# Altium schematic sheet Radio.SchDoc
size A; SheetNumber: 5; SheetTotal: 5; SPICEModelCacheYGONGDQV: <root> / <DocumentId>YGONGDQV</DocumentId> / <CacheFrame Number="0"> / <Model Name="pmos" Kind="MDL"> / <Text>*Default P-Channel MOSFET / *Pinout: D,G,S / .MODEL PMOS PMOS()</Text> / </Model> / <Model Name="cap" Kind="MDL"> / <Text>*Default semiconductor capacitor / .MODEL CAP C()</Text> / </Model> / </CacheFrame> / </root>
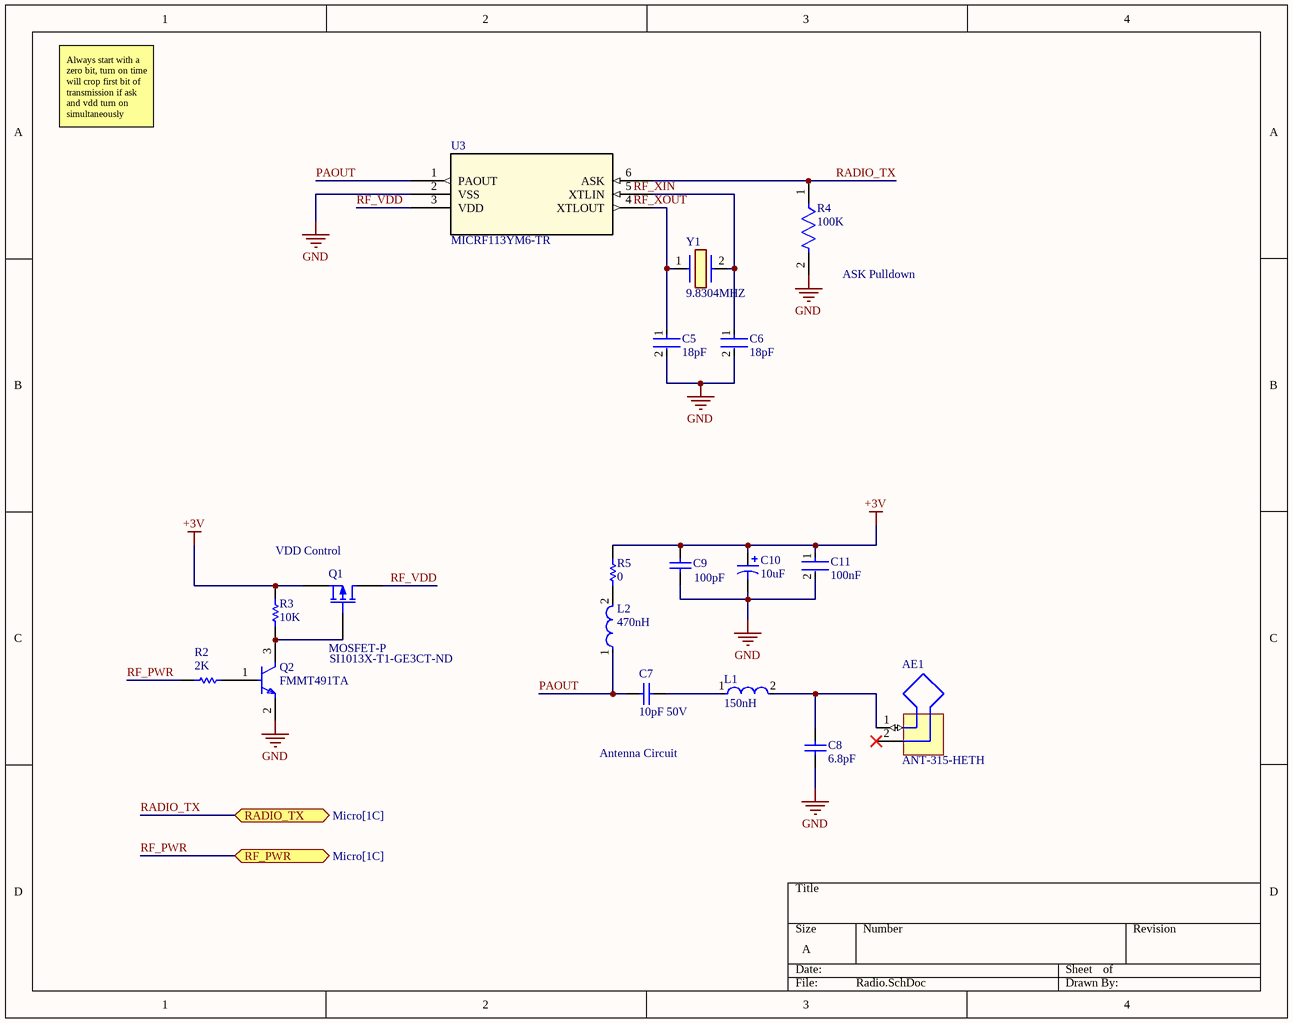
[diagram p0: Radio.SchDoc]

## Parts
AE1  ANT-315-HETH  [ANT-xxx-HETH]
C5  18pF  [FP-0402-L_1_0_1-W_0_5_0_1-MFG]
C6  18pF  [FP-0402-L_1_0_1-W_0_5_0_1-MFG]
C7  10pF 50V  [CAPC1608X90X35LL10T15]
C8  6.8pF  [CAPC1005X55X25NL05T10]
C9  100pF  [CAPC1608X90X35NL10T15]
C10  10uF  [C0805]
C11  100nF  [FP-C0402-BB-MFG]
L1  150nH  [FP-LQM18NN_00-IPC_B]
L2  470nH  [FP-LQW2UAS_00-MFG]
Q1  MOSFET-P  Supplier Part Number 1: SI1013X-T1-GE3CT-ND  [SC89-3_0P95X1P7_ONS]
Q2  FMMT491TA  [FP-SOT23-MFG]
R2  2K  [RESC1005X40X25LL05T05]
R3  10K  [RESC1005X40X25LL05T05]
R4  100K  [FP-ERJ2RK-IPC_C]
R5  0  [RESC1005X40X25LL05T05]
U3  MICRF113YM6-TR  [SOT23-6_N]
Y1  9.8304MHZ  [HC/49US-(AT49)_1]

## Ports
RADIO_TX (bidir, see Micro[1C]), RF_PWR (bidir, see Micro[1C])

## Nets
+3V: C9.2 C10.1 C11.1 Q1.3(S) R3.2 R5.2
GND: C5.2 C6.2 C8.1 C9.1 C10.2 C11.2 Q2.2(E) R4.2 U3.2(VSS)
PAOUT: C7.1 L2.1 U3.1(PAOUT)
RADIO_TX: R4.1 U3.6(ASK) ; port RADIO_TX
RF_PWR: R2.1 ; port RF_PWR
RF_VDD: Q1.1(D) U3.3(VDD)
NetAE1_1: AE1.1(High_Band_Feed) C8.2 L1.2
NetC5_1: C5.1 U3.4(XTLOUT) Y1.1
NetC6_1: C6.1 U3.5(XTLIN) Y1.2
NetC7_2: C7.2 L1.1
NetL2_2: L2.2 R5.1
NetQ1_2: Q1.2(G) Q2.3(C) R3.1
NetQ2_1: Q2.1(B) R2.2

Not connected (* = marked no-connect by the designer): AE1 2(Low_Band_Feed)*

## Notes on the sheet
- Always start with a zero bit, turn on time will crop first bit of transmission if ask and vdd turn on simultaneously
- (near R4) ASK Pulldown
- VDD Control
- Antenna Circuit
- Labels drawn without touching a wire or pin: RF_XIN, RF_XOUT

## Library data of the parts
AE1 = CMP-0172-00019-1: Embeddable 1/4-wave Monopole Antenna, HE Series, 315MHz, Thru-Hole; PackageReference: ANT-xxx-HETH; PackageDescription: Helical Antenna, HE Series, Thru-Hole, 2-Lead, 1.5" x 0.35" Body; DatasheetVersion: Feb-2002; PackageVersion: Feb-2002
C5 C6 = CMP-1034-00865-3: General Purpose Ceramic Capacitor, 0402, 18pF, 5%, C0G, 30ppm/°C, 50V; Insulation Resistance: 100GR; Length: 1mm; Voltage Rating (DC): 50V; Dielectric: C0G; Dielectric Material: Ceramic; Thickness: 0.022inch; Max Operating Temperature: 125°C; Min Operating Temperature: -55°C; RoHS Compliant: Yes; Package Quantity: 1; Mount: Surface Mount; Case Code (Imperial): 0402; REACH SVHC: No SVHC; Termination: SMD/SMT; Voltage: 50V; Number of Pins: 2; Contact Plating: Tin; Radiation Hardening: No; Voltage Rating: 50V; Capacitance: 18pF; Case Code (Metric): 1005; Case/Package: 0402; Tolerance: 5%; Packaging: Tape and Reel; Temperature Coefficient: 0ppm/°C; Depth: 0.5mm; Width: 0.02inch; Lead Free: Lead Free; Height: 0.5mm
C7 = CMP-2006-02592-1: Part Number: GRM1885C1H100JA01D; Manufacturer: Murata; Supplier 1: Digi-Key; Supplier Part Number 1: 490-1403-1-ND
C8 = CMP-2008-04424-1: Manufacturer: Murata; Part Number: GRM1555C1H6R8DA01D
C9 = CMP-2006-02595-1: Part Number: GRM1885C1H101JA01D; Manufacturer: Murata; Supplier 1: Digi-Key; Supplier Part Number 1: 490-1427-6-ND
C10 = Cap Pol3: Alum. Electrolytic Cap 10µF 50V; 5mm Surface Mount; Lifetime 2000h; +105°C; Manufacturer: Wurth Electronics; Manufacturer Part Number: 865080642006; Polarity: Polar; Ripple Current: 95mA; Impedance: 2.8R; Life (Hours): 2000Hour; Tolerance: 20%; Published: 8-Jun-2000; LatestRevisionDate: 29-May-2009; LatestRevisionNote: IPC-7351 Footprint Added.; PackageReference: C0805; Publisher: Altium Limited; PackageDescription: Chip Capacitor; RoHS: Yes; Category: Aluminum Electrolytic Capacitors; Stock 1: 1; Pricing 1: 25=0.20400 (USD); Mount: Surface Mount; Case/Package: Radial; Min Operating Temperature: -55°C; Max Operating Temperature: 105°C; Package Quantity: 1; Packaging: Cut Tape; Voltage Rating: 50V; Ripple Current (AC): 95mA; Voltage Rating (DC): 50V; Capacitance: 10uF; Diameter: 5mm; Height: 5.5mm; Height - Seated (Max): 0.217inch; REACH SVHC: Unknown; RoHS Compliant: Yes; ComponentLink1URL: http://www.farnell.com/datasheets/1880176.pdf?src-supplier=Farnell; ComponentLink1Description: http://www.farnell.com/datasheets/1880176.pdf?src-supplier=Farnell; ComponentLink2URL: http://www.farnell.com/datasheets/1880176.pdf?src-supplier=Element14; ComponentLink2Description: http://www.farnell.com/datasheets/1880176.pdf?src-supplier=Element14; ComponentLink3URL: http://www.farnell.com/datasheets/1880176.pdf?src-supplier=Newark; ComponentLink3Description: http://www.farnell.com/datasheets/1880176.pdf?src-supplier=Newark; ComponentLink4URL: http://katalog.we-online.de/pbs/datasheet/865080642006.pdf?src-supplier=Digi-Key; ComponentLink4Description: http://katalog.we-online.de/pbs/datasheet/865080642006.pdf?src-supplier=Digi-Key; ComponentLink5URL: https://katalog.we-online.de/pbs/datasheet/865080642006.pdf?src-supplier=Digi-Key; ComponentLink5Description: https://katalog.we-online.de/pbs/datasheet/865080642006.pdf?src-supplier=Digi-Key; Supplier 1: RSComponents; Supplier Part Number 1: 8391862P
C11 = CMP-2008-02046-2: CAP CER 0.1UF 10V X5R 0402; Manufacturer: Kemet; Manufacturer Part Number: C0402C104K8PACTU; Material: Ceramic; Capacitance: 0.10 μF; Temperature Coefficient: 15%; Tolerance: 0.1; Value: 0.10 μF; Package: C0402-BB; Temperature: -55°C to +125°C; ComponentLink2Description: Datasheet; Temperature Characteristic: X5R; Device Class L1: Passive Components; Height: 0.55mm; Lead Free: Yes; ComponentLink2URL: https://content.kemet.com/datasheets/KEM_C1002_X7R_SMD.pdf; Device Class L2: Capacitors; Temperature Range Low: -55°C; Temperature Range High: +125°C; RoHS: TRUE; Octopart: https://octopart.com/c0402c104k8pactu-kemet-140039; Automotive: No; Mouser Description: Capacitor 100 nF 10 VDC 0402; Category: Cap; Voltage Rating: 10 V; Digikey Description: CAP CER 0.1UF 10V X5R 0402; Ipc Land Pattern Name: CAPC10050X50; Device Class L3: Ceramic Capacitors
L1 = CMP-06042-016466-1: Multilayer Type Inductor for General Circuits, 0603 (1608), 150nH, 10%, 0.6Ω, 50mA; Shielding: Shielded; Inductor Type: MONOLITHIC; Q Factor: 15; DC Resistance (DCR): 600mR; Self Resonant Frequency: 180MHz; Test Frequency: 25MHz; Core Material: Ferrite; Military Standard: Not; Inductance Tolerance: 10%; Length: 1.6mm; Tolerance: 10%; Height - Seated (Max): 0.035inch; Inductance: 150nH; Current Rating: 50mA; REACH SVHC: No SVHC; Case Code (Imperial): 0603; Series: LQM18N; Width: 0.8mm; Packaging: Tape and Reel; DC Current: 50mA; Termination: SMD/SMT; Max Operating Temperature: 85°C; Package Quantity: 4000; Case/Package: 0603; Case Code (Metric): 1608; Number of Pins: 2; Height: 0.8mm; Min Operating Temperature: -40°C; Max DC Current: 50mA; Lead Free: Lead Free; Depth: 0.95mm; Mount: Surface Mount; Supplier 1: Digi-Key; Supplier Part Number 1: 490-4033-1-ND
L2 = CMP-06042-015512-1: Wire Wound RF Inductor 470nH ±5% 470mA 1.19Ω 1008 (2520); Test Frequency: 25MHz; DC Resistance (DCR): 1.19R; Core Material: Air; Shielding: Unshielded; Self Resonant Frequency: 450MHz; Q Factor: 45; Case Code (Metric): 2520; Packaging: Tape and Reel; Inductance: 470nH; Tolerance: 5%; Width: 0.096inch; Radiation Hardening: No; Case Code (Imperial): 1008; Resistor Type: Wirewound; Depth: 2.65mm; Min Operating Temperature: -55°C; Inductance Tolerance: 5%; Max DC Current: 470mA; Mount: Surface Mount; Series: LQW2UA; Max Operating Temperature: 125°C; REACH SVHC: No SVHC; Termination: SMD/SMT; Current Rating: 470mA; Height - Seated (Max): 0.08inch; Package Quantity: 2000; Height: 1.83mm; Lead Free: Lead Free; Length: 0.103inch; Weight: 0.001376oz; Case/Package: 1008; Supplier 1: Digi-Key; Supplier Part Number 1: 490-5699-6-ND
Q1 = MOSFET-P: Single P-Channel 20 V 1.2 Ohm Surface Mount Power Mosfet - SC-89; Manufacturer: Vishay Siliconix; Manufacturer Part Number: SI1013X-T1-GE3; Rds On Max: 1.2R; Rise Time: 9ns; Drain to Source Voltage (Vdss): 20V; Continuous Drain Current (ID): 350mA; Max Power Dissipation: 250mW; Gate to Source Voltage (Vgs): 6V; Turn-Off Delay Time: 35ns; Number of Elements: 1; Turn-On Delay Time: 5ns; Threshold Voltage: -450mV; Drain to Source Breakdown Voltage: -20V; Published: 8-Jun-2000; LatestRevisionDate: 17-Jul-2002; LatestRevisionNote: Re-released for DXP Platform.; PackageVersion: 1995/1996; PackageReference: E3; Publisher: Altium Limited; PackageDescription: TO, Flat Index; 3 In-Line, Axial Leads; Body Dia. 4.6mm; Lead Dia. 0.5 mm (max); Supplier 1: Digi-Key; RoHS: Yes; Category: MOSFETs; Stock 1: 2646; Pricing 1: 1=0.46000, 10=0.39200, 100=0.29260, 500=0.22990, 1000=0.17765 (USD); Mount: Surface Mount; Case/Package: SC; Number of Pins: 3; Weight: 0.001058oz; Min Operating Temperature: -55°C; Max Operating Temperature: 150°C; Package Quantity: 1; Packaging: Tape and Reel; Drain to Source Resistance: 1.2R; Fall Time: 9ns; Power Dissipation: 250mW; Element Configuration: Single; Number of Channels: 1; On-State Resistance: 1.2R; Polarity: P-CHANNEL; Series: TrenchFET®; Drain-source On Resistance-Max: 1.2R; Length: 1.7mm; Width: 0.95mm; Height: 0.8mm; Radiation Hardening: No; REACH SVHC: Unknown; Lead Free: Lead Free; RoHS Compliant: Yes; ComponentLink1URL: https://datasheet.ciiva.com/22671/1825082-22671731.pdf?src-supplier=Element14; ComponentLink1Description: https://datasheet.ciiva.com/22671/1825082-22671731.pdf?src-supplier=Element14; ComponentLink2URL: https://datasheet.ciiva.com/931/71167-931890.pdf?src-supplier=Digi-Key; ComponentLink2Description: https://datasheet.ciiva.com/931/71167-931890.pdf?src-supplier=Digi-Key; ComponentLink3URL: https://datasheet.ciiva.com/931/71167-931891.pdf?src-supplier=Digi-Key; ComponentLink3Description: https://datasheet.ciiva.com/931/71167-931891.pdf?src-supplier=Digi-Key; ComponentLink4URL: https://datasheet.ciiva.com/931/71167-931892.pdf?src-supplier=Digi-Key; ComponentLink4Description: https://datasheet.ciiva.com/931/71167-931892.pdf?src-supplier=Digi-Key; ComponentLink5URL: https://datasheet.ciiva.com/11161/71167-11161420.pdf?src-supplier=Avnet; ComponentLink5Description: https://datasheet.ciiva.com/11161/71167-11161420.pdf?src-supplier=Avnet; ComponentLink6URL: https://datasheet.ciiva.com/16217/71167-16217575.pdf?src-supplier=Future+Electronics; ComponentLink6Description: https://datasheet.ciiva.com/16217/71167-16217575.pdf?src-supplier=Future+Electronics
Q2 = CMP-12798-000044-1: TRANS NPN 60V 1A SOT23-3; Element Configuration: Single; Transition Frequency: 150MHz; Number of Elements: 1; hFE Min: 100; Emitter Base Voltage (VEBO): 5V; Max Power Dissipation: 500mW; Collector Base Voltage (VCBO): 80V; Collector Emitter Saturation Voltage: 160mV; Weight: 0.000282oz; Width: 1.4mm; Collector Emitter Breakdown Voltage: 60V; Gain Bandwidth Product: 150MHz; Voltage Rating (DC): 60V; Max Breakdown Voltage: 60V; Max Collector Current: 1A; Max Operating Temperature: 150°C; Radiation Hardening: No; Number of Pins: 3; Length: 3.04mm; Height: 1.02mm; Packaging: Tape and Reel; Frequency: 150MHz; Min Operating Temperature: -55°C; Current Rating: 1A; Package Quantity: 3000; Mount: Surface Mount; Power Dissipation: 500mW; Case/Package: SOT-23; Polarity: NPN; Termination: SMD/SMT; REACH SVHC: No SVHC; Max Frequency: 150MHz; Lead Free: Lead Free; Collector Emitter Voltage (VCEO): 60V; Continuous Collector Current: 1A; Supplier 1: RSComponents; Supplier Part Number 1: 0274879P
R2 = CMP-2000-07588-1: Chip Resistor, 2 KOhm, +/- 1%, 0.1 W, -55 to 155 degC, 0402 (1005 Metric), RoHS, Tape and Reel; Manufacturer: Panasonic; Manufacturer Part Number: ERJ-2GEJ202X; Power Rating: 100mW; Voltage Rating: 50V; Resistance: 10KOhm; Case\/Package: 0402; Temperature Coefficient: 100ppm\/degreesC; Description: Res Thick Film 0402 2K Ohm 5% 1/10W ±200ppm/°C Molded SMD Punched Carrier T/R; Resistance Tolerance: 5%; RoHSCompliant: True; Lead Free: LeadFree; Package Quantity: 1; Contact Plating: Tin; Length: 1mm; Radiation Hardening: No; REACH SVHC: NoSVHC; Max Operating Temperature: 155degC; Depth: 0.5mm; Case Code (Imperial): 0402; Military Standard: Not; Package Description: 2-Pin Surface Mount Device, Body 1 x 0.5 mm; Termination: SMD/SMT; Case Code (Metric): 1005; Height: 0.35mm; Packaging: TapeandReel; Voltage Rating (DC): 50V; Package Reference: 402; Number of Pins: 2; Tolerance: 1%; Mounting Technology: SurfaceMount; Width: 0.02inch; Mount: SurfaceMount; Datasheet URL: https://industrial.panasonic.com/cdbs/www-data/pdf/RDA0000/AOA0000C304.pdf; Composition: ThickFilm; Datasheet Version: 02/2017; Manufacturer URL: http://www.panasonic.com/; Max Power Dissipation: 100mW; Number of Terminations: 2; Min Operating Temperature: -55degC; Supplier 1: RSComponents; RoHS: Yes; Category: Chip SMD Resistors; Stock 1: 1; Pricing 1: 10000=0.00900 (USD); Case/Package: 0402; Resistor Type: Thick Film; Series: ERJ; Construction: Rectangular; Features: Automotive AEC-Q200; Technology: THICK FILM; RoHS Compliant: Yes; ComponentLink1URL: https://datasheet.ciiva.com/34303/1986861-34303546.pdf?src-supplier=Jameco; ComponentLink1Description: https://datasheet.ciiva.com/34303/1986861-34303546.pdf?src-supplier=Jameco; ComponentLink2URL: https://datasheet.ciiva.com/11821/0900766b80f806dd-11821274.pdf?src-supplier=RSComponents; ComponentLink2Description: https://datasheet.ciiva.com/11821/0900766b80f806dd-11821274.pdf?src-supplier=RSComponents; ComponentLink3URL: https://datasheet.ciiva.com/43460/1500035-43460382.pdf?src-supplier=Farnell; ComponentLink3Description: https://datasheet.ciiva.com/43460/1500035-43460382.pdf?src-supplier=Farnell; ComponentLink4URL: https://datasheet.ciiva.com/46389/1500035-46389063.pdf?src-supplier=Element14; ComponentLink4Description: https://datasheet.ciiva.com/46389/1500035-46389063.pdf?src-supplier=Element14; ComponentLink5URL: https://datasheet.ciiva.com/28546/1678796-28546090.pdf?src-supplier=Element14; ComponentLink5Description: https://datasheet.ciiva.com/28546/1678796-28546090.pdf?src-supplier=Element14; ComponentLink6URL: https://datasheet.ciiva.com/28673/1678796-28673966.pdf?src-supplier=Element14; ComponentLink6Description: https://datasheet.ciiva.com/28673/1678796-28673966.pdf?src-supplier=Element14; ComponentLink7URL: https://datasheet.ciiva.com/24026/aoa0000ce1-37422-24026406.pdf?src-supplier=Mouser; ComponentLink7Description: https://datasheet.ciiva.com/24026/aoa0000ce1-37422-24026406.pdf?src-supplier=Mouser; ComponentLink8URL: https://datasheet.ciiva.com/16760/70260739-16760199.pdf?src-supplier=Allied+Electronics; ComponentLink8Description: https://datasheet.ciiva.com/16760/70260739-16760199.pdf?src-supplier=Allied+Electronics; ComponentLink9URL: https://datasheet.ciiva.com/16760/70260739-16760559.pdf?src-supplier=Allied+Electronics; ComponentLink9Description: https://datasheet.ciiva.com/16760/70260739-16760559.pdf?src-supplier=Allied+Electronics; ComponentLink10URL: https://datasheet.ciiva.com/9197/aoa0000ce1-9197500.pdf?src-supplier=Avnet; ComponentLink10Description: https://datasheet.ciiva.com/9197/aoa0000ce1-9197500.pdf?src-supplier=Avnet; Supplier 2: RSComponents; Stock 2: 1; Pricing 2: 10000=0.00900 (USD)
R3 = CMP-2000-07588-1: Chip Resistor, 10 KOhm, +/- 1%, 0.1 W, -55 to 155 degC, 0402 (1005 Metric), RoHS, Tape and Reel; Manufacturer: Panasonic; Power Rating: 100mW; Voltage Rating: 50V; Resistance: 10KOhm; Case\/Package: 0402; Temperature Coefficient: 100ppm\/degreesC; RoHSCompliant: True; Lead Free: LeadFree; Package Quantity: 1; Contact Plating: Tin; Length: 1mm; Radiation Hardening: No; REACH SVHC: NoSVHC; Max Operating Temperature: 155degC; Depth: 0.5mm; Case Code (Imperial): 0402; Military Standard: Not; Package Description: 2-Pin Surface Mount Device, Body 1 x 0.5 mm; Termination: SMD/SMT; Case Code (Metric): 1005; Height: 0.35mm; Packaging: TapeandReel; Voltage Rating (DC): 50V; Package Reference: 402; Number of Pins: 2; Tolerance: 1%; Mounting Technology: SurfaceMount; Width: 0.02inch; Mount: SurfaceMount; Datasheet URL: https://industrial.panasonic.com/cdbs/www-data/pdf/RDA0000/AOA0000C304.pdf; Composition: ThickFilm; Datasheet Version: 02/2017; Manufacturer URL: http://www.panasonic.com/; Max Power Dissipation: 100mW; Number of Terminations: 2; Min Operating Temperature: -55degC
R4 = CMP-2002-00608-4: RES SMD 100K OHM 1% 1/10W 0402; Resistance: 100kR; Voltage Rating (DC): 50V; Power Rating: 100mW; Temperature Coefficient: 100ppm/°C; Case/Package: 0402; Length: 1mm; Package Quantity: 1; Radiation Hardening: No; Case Code (Metric): 1005; Contact Plating: Tin; Mount: Surface Mount; Depth: 0.5mm; Max Operating Temperature: 155°C; Lead Free: Lead Free; Width: 0.5mm; Composition: Thick Film; Case Code (Imperial): 0402; Tolerance: 1%; Termination: SMD/SMT; Number of Pins: 2; Height: 0.35mm; Voltage Rating: 50V; Military Standard: Not; REACH SVHC: No SVHC; Packaging: Tape and Reel; Min Operating Temperature: -55°C; Max Power Dissipation: 100mW; Features: Automotive AEC-Q200; Number of Terminations: 2; Supplier 1: Arrow Electronics; Supplier Part Number 1: ERJ-2RKF1003X
R5 = CMP-2000-07451-1: Chip Resistor, 0 Ohm, 0.1 W, -55 to 155 degC, 0402 (1005 Metric), RoHS, Tape and Reel; Manufacturer: Panasonic; Voltage Rating (DC): 50V; Temperature Coefficient: 600ppm/��C; Max Power Dissipation: 100mW; Resistance: 0mOhm; Tolerance: 5%; Number of Terminations: 2; Mount: SurfaceMount; Height: 0.35mm; Packaging: TapeandReel; Contact Plating: Tin; Manufacturer URL: http://www.panasonic.com/; Composition: ThickFilm; Max Operating Temperature: 155degC; REACH SVHC: NoSVHC; Case/Package: 0402; Package Reference: 402; Depth: 0.5mm; Package Description: 2-Pin Surface Mount Device, Body 1 x 0.5 mm; Datasheet URL: https://industrial.panasonic.com/cdbs/www-data/pdf/RDA0000/AOA0000C301.pdf; RoHSCompliant: True; Case Code (Imperial): 0402; Military Standard: Not; Min Operating Temperature: -55degC; Power Rating: 100mW; Datasheet Version: 03/2015; Length: 1mm; Case Code (Metric): 1005; Termination: SMD/SMT; Mounting Technology: SurfaceMount; Voltage Rating: 50V; Width: 0.02inch; Package Quantity: 1; Lead Free: LeadFree; Radiation Hardening: No; Supplier 1: Digi-Key; Supplier Part Number 1: P0.0JCT-ND
U3 = MICRF113YM6-TR: No Description Available; Mfr_Name: Microchip; Copyright: Copyright (C) 2022 Ultra Librarian. All rights reserved.; Manufacturer_Part_Number: MICRF113YM6-TR; Digi-Key_Part_Number_1: 576-3229-1-ND; Digi-Key_Part_Number_2: 576-3229-2-ND; Digi-Key_Part_Number_3: 576-3229-2-NDL; Digi-Key_Part_Number_4: 576-3229-6-ND; RefDes: RefDes; Type: DEV
Y1 = ABLS2-16.000MHZ-D4Y-T: Crystal or Oscillator; Manufacturer_Name: ABRACON; Datasheet Link: https://abracon.com/Resonators/ABLS2.pdf; Manufacturer_Part_Number: ABLS2-16.000MHZ-D4Y-T; Mouser Part Number: 815-ABLS2-16-D4Y-T; Mouser Price/Stock: https://www.mouser.co.uk/ProductDetail/ABRACON/ABLS2-16.000MHZ-D4Y-T?qs=LoTOQoUkC8S5C2377M50iA%3D%3D; Arrow Part Number: ABLS2-16.000MHZ-D4Y-T; Arrow Price/Stock: https://www.arrow.com/en/products/abls2-16.000mhz-d4y-t/abracon?region=nac